# Altium schematic sheet battery_charger.SchDoc
size A
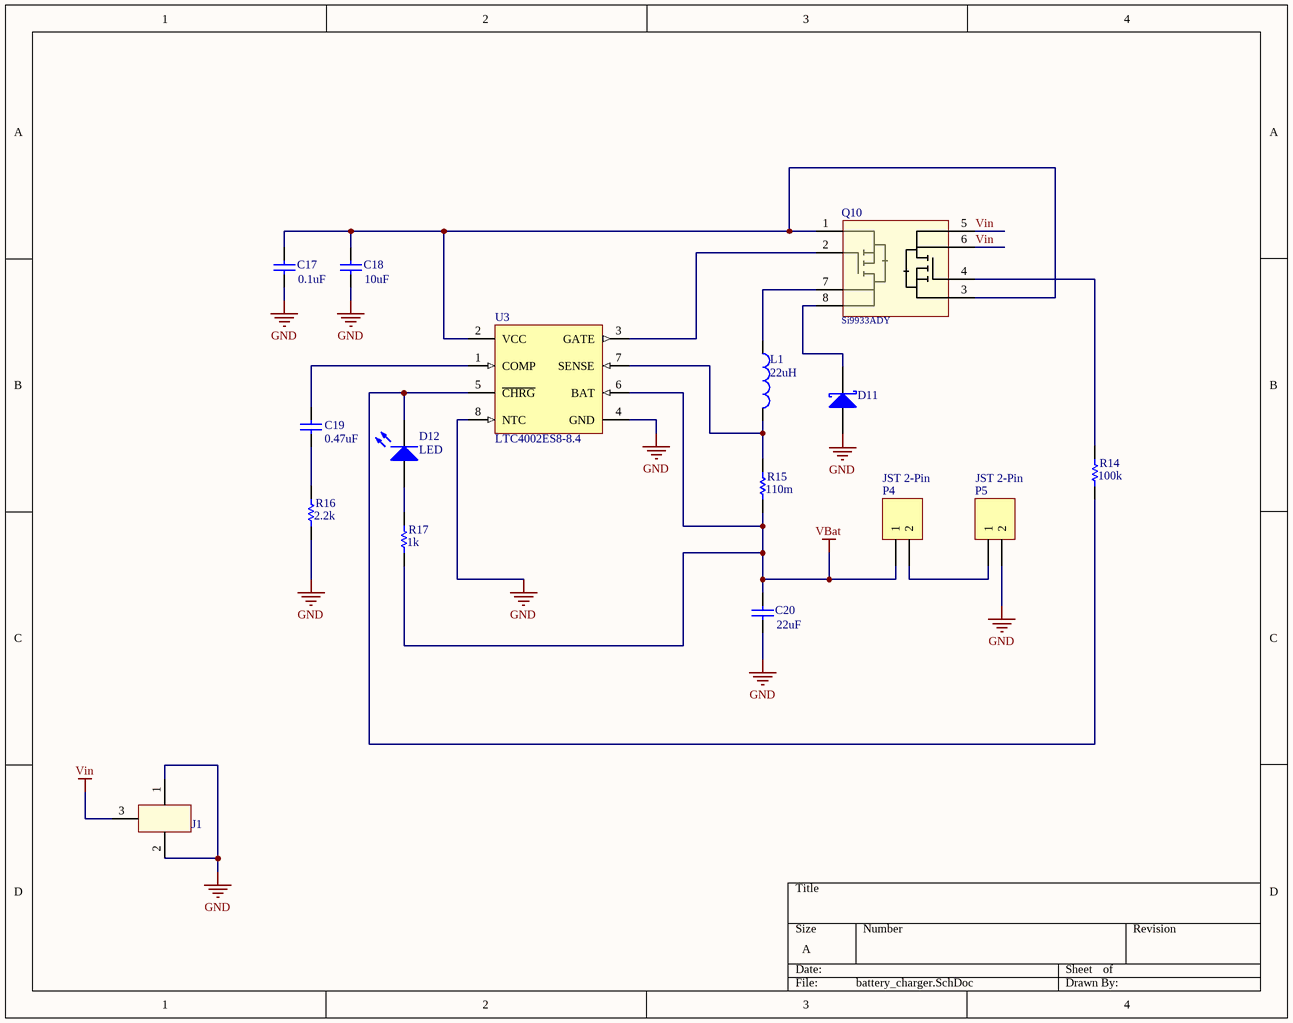
[diagram p0: battery_charger.SchDoc]

## Parts
C17  value 0.1uF  [1608[0603]]  (hidden comment: Cap Semi)
C18  value 10uF  [C1210]  (hidden comment: Cap Semi)
C19  value 0.47uF  [1608[0603]]  (hidden comment: Cap Semi)
C20  value 22uF  [C1210]  (hidden comment: Cap Semi)
D11  D Schottky  [SMB]  (value not drawn)
D12  LED  [0603]
J1  DC Barrel Jack  [DC Barrel Jack]  (value not drawn)
L1  value 22uH  [INDC6060X49N]  (hidden comment: Inductor)
P4  JST 2-Pin  [JST Connector 2-pin]
P5  JST 2-Pin  [JST Connector 2-pin]
Q10  Dual P-Channel  [SOIC-8]  (value not drawn)
R14  value 100k  [0603]  (hidden comment: Resistor)
R15  value 110m  [0603]  (hidden comment: Resistor)
R16  value 2.2k  [0603]  (hidden comment: Resistor)
R17  value 1k  [0603]  (hidden comment: Resistor)
U3  LTC4002ES8-8.4  [LT-S8-8_N]

## Nets
GND: C17.1 C18.1 C20.1 D11.1(A) J1.1(Casing) J1.2(Casing) P5.2 R16.1 U3.4(GND) U3.8(NTC)
VBat: C20.2 P4.1 R15.1 R17.1 U3.6(BAT)
Vin: J1.3(Center) Q10.5(D2) Q10.6(D2)
NetC17_2: C17.2 C18.2 Q10.1(S1) Q10.3(S2) U3.2(VCC)
NetC19_1: C19.1 R16.2
NetC19_2: C19.2 U3.1(COMP)
NetD11_2: D11.2(K) Q10.8(D1)
NetD12_1: D12.1(A) R17.2
NetD12_2: D12.2(K) R14.1 U3.5(~{CHRG})
NetL1_1: L1.1 Q10.7(D1)
NetL1_2: L1.2 R15.2 U3.7(SENSE)
NetP4_2: P4.2 P5.1
NetQ10_2: Q10.2(G1) U3.3(GATE)
NetQ10_4: Q10.4(G2) R14.2

## Library data of the parts
C17-C20 = Cap Semi: Capacitor (Semiconductor SIM Model); Published: 8-Jun-2000; LatestRevisionDate: 29-May-2009; LatestRevisionNote: IPC-7351 Footprint Added.; PackageReference: C1206; Publisher: Altium Limited; PackageDescription: Chip Capacitor
D11 = D Schottky: Schottky Diode; Published: 8-Jun-2000; LatestRevisionDate: 17-Jul-2002; LatestRevisionNote: Re-released for DXP Platform.; PackageReference: SMB; Publisher: Altium Limited; PackageDescription: DO-214-AA/SMB; 2 C-Bend Leads; Body 5.3 x 3.6 mm, inc. leads (LxW); Code_JEDEC: DO-214-AA
D12 = LED: Vendor Part Number: 751-1203-ND; Manufacturer: Vishay; Manufacturer Part Number: TSAL6100; Vendor: Digikey; Published: 16-Mar-2013; LatestRevisionDate: 16-Mar-2013; LatestRevisionNote: Created; PackageReference: LED; Publisher: Anthony Merlino; PackageDescription: 5mm LED; 2 Leads
J1 = DC Barrel Jack: DC Barrel Jack, Fits 5mm DC Wall Adapter
L1 = Inductor: Code_IEC: 1005; Published: 8-Jun-2000; LatestRevisionDate: 29-May-2009; LatestRevisionNote: IPC-7351 Footprint Added.; PackageReference: 0402-A; Publisher: Altium Limited; PackageDescription: Chip Inductor; Code_JEITA: 0402
P4 P5 = JST Connector 2-Pin: Header, 2-Pin; LatestRevisionDate: 17-Jul-2002; LatestRevisionNote: Re-released for DXP Platform.; Publisher: Altium Limited
Q10 = Si9933ADY: Dual P-Channel 20-V (D-S) MOSFET; Manufacturer Part N.O.: Si9933ADY
U3 = LTC4002ES8-8.4: Standalone Li-Ion Switch Mode Battery Charger, 8.9 to 22 V Vin, 8-pin SOIC (S8-8), -40 to 85 degC; Manufacturer: Linear Technology; Battery Chemistry: Li-Ion, Li-Polymer; Charge Termination: On-board timer; Float Voltage: 8.4 V; Number of Cells: 2; Type of Charger: Switching; Vin Max(V): 22; Vin Min(V): 8.9; PackageVersion: Rev. G, 03/2012; PackageReference: S8-8; PackageDescription: 8-Pin Plastic Small Outline (Narrow .150 Inch), Body 4.9 x 3.9 mm, Pitch 1.27 mm; Supplier 1: Digi-Key; Supplier Part Number 1: LTC4002ES8-8.4-ND; RoHS: FALSE; Mounting Technology: Surface Mount; PartNumber: LTC4002ES8-8.4; ComponentLink1Description: Manufacturer URL; ComponentLink1URL: http://www.linear.com/; ComponentLink2Description: Datasheet; ComponentLink2URL: http://cds.linear.com/docs/en/datasheet/4002f.pdf; ComponentLink3Description: Package Specification; ComponentLink3URL: http://cds.linear.com/docs/en/packaging/05081610_G_SO8.pdf
R14-R17 = Resistor: Published: 8-Jun-2000; LatestRevisionDate: 17-Jul-2002; LatestRevisionNote: Re-released for DXP Platform.; PackageReference: AXIAL-0.3; Publisher: Altium Limited